# Altium schematic sheet LoRa.SchDoc
size A4; SheetNumber: 5; SheetTotal: 7
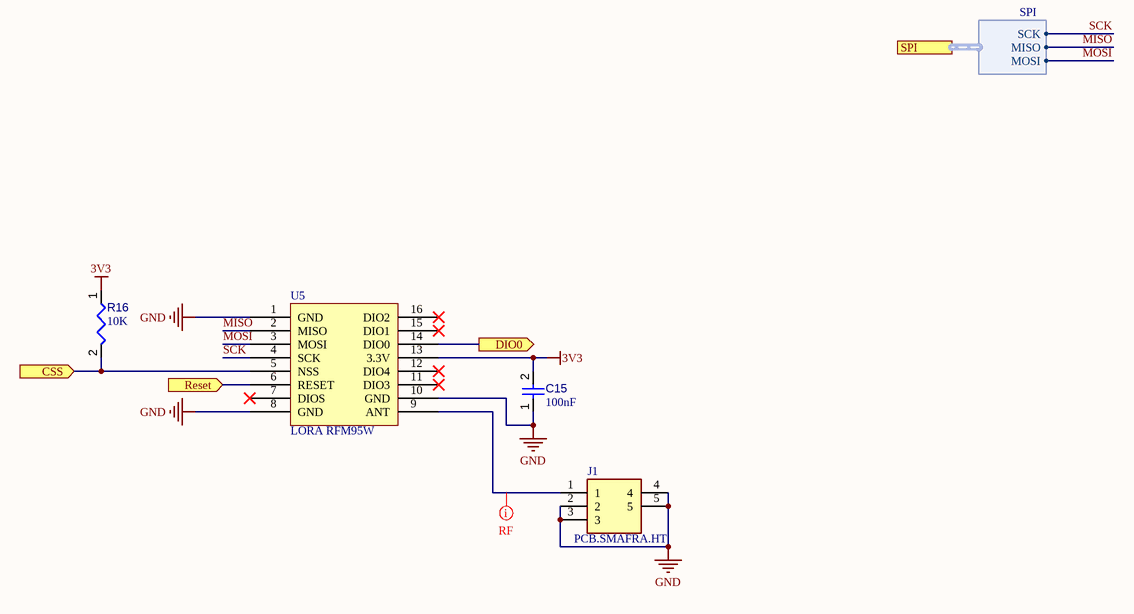
[diagram p0: LoRa.SchDoc]

## Parts
C15  value 100nF  [CAPC0805(2012)145_L]  (hidden comment: Capacitor 100µF +/-20% 6.3V 0805)
J1  PCB.SMAFRA.HT  [PCBSMAFRAHT]
R16  value 10K  [RESC0805(2012)_L]  (hidden comment: Resistor 4R7  +/-5 % 0805 125 mW)
U5  LORA RFM95W  [LORA RFM95W - duplicate1]

## Ports
CSS (in), DIO0 (out), Reset (in), SPI (harness SPI)

## Harnesses
SPI: SCK, MISO, MOSI

## Nets
3V3: C15.2 R16.1 U5.13(3.3V)
GND: C15.1 J1.2 J1.3 J1.4 J1.5 U5.1(GND) U5.8(GND) U5.10(GND)
CSS: R16.2 U5.5(NSS) ; port CSS
DIO0: U5.14(DIO0) ; port DIO0
MISO: U5.2(MISO) ; port SPI.MISO
MOSI: U5.3(MOSI) ; port SPI.MOSI
Reset: U5.6(RESET) ; port Reset
SCK: U5.4(SCK) ; port SPI.SCK
NetJ1_1: J1.1 U5.9(ANT)

Not connected (* = marked no-connect by the designer): U5 7(DIOS)* 11(DIO3)* 12(DIO4)* 15(DIO1)* 16(DIO2)*

## Layout directives
mark named RF: NetJ1_1

## Notes on the sheet
- Author:
- Title:
- Sheet number:
- Modified:
- /
- Reviewers:
- Description:

## Library data of the parts
C15 = CMP-001-00054-4: Chip Capacitor, 100µF +/-20%, 6.3V, 0805, Thickness 1.45 mm; Tolerance: 10%; Min Operating Temperature: -55°C; Max Operating Temperature: 85°C; Pins: 2; Mounting Technology: SMT; Case/Package: 0805; Voltage Rating: 6.3V
J1 = CMP-002-000386-1: Connector; Manufacturer_Name: Taoglas; Height: 9mm; Mouser Price/Stock: https://www.mouser.co.uk/ProductDetail/Taoglas/PCB.SMAFRA.HT?qs=RuW%2Fu%252BNMQmubIFYcN8w5Dw%3D%3D; Design Item ID: PCB.SMAFRA.HT; Mouser Part Number: 960-PCB.SMAFRA.HT; Manufacturer_Part_Number: PCB.SMAFRA.HT; Source: SamacSys.SchLib; Datasheet Link: https://www.mouser.com/datasheet/2/398/PCB.SMAFRA.HT_-1220750.pdf
R16 = CMP-009-00174-3: Chip Resistor, 4,7 Ohms, +/-5 %, 125 mW, -55 to 155 degC, 0805; Tolerance: 5%; Power: 125mW; Max Operating Temperature: 155°C; Case/Package: 0805; Min Operating Temperature: -55°C; Pins: 2
U5 = CMP-002-000179-2: Source: LORA RFM95W.SchLib; Design Item ID: LORA RFM95W; Component Type: Standard; Pin Count: 16